# EAGLE design untitled (EAGLE 7.7.0)
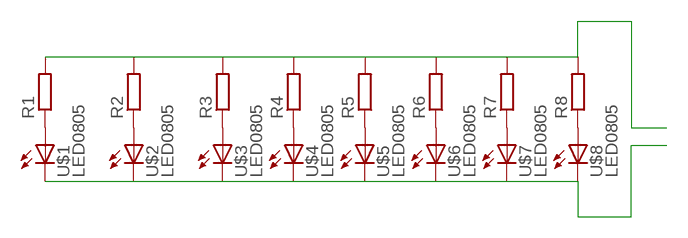
[diagram p0: schematic, sheet 1]

## Parts
R1  R0603  [0603]
R2  R0603  [0603]
R3  R0603  [0603]
R4  R0603  [0603]
R5  R0603  [0603]
R6  R0603  [0603]
R7  R0603  [0603]
R8  R0603  [0603]
U$1  LED0805  [0805-LED]
U$2  LED0805  [0805-LED]
U$3  LED0805  [0805-LED]
U$4  LED0805  [0805-LED]
U$5  LED0805  [0805-LED]
U$6  LED0805  [0805-LED]
U$7  LED0805  [0805-LED]
U$8  LED0805  [0805-LED]

## Nets
N$1: R1.1 U$1.A
N$2: R2.1 U$2.A
N$3: R3.1 U$3.A
N$4: R4.1 U$4.A
N$5: R5.1 U$5.A
N$6: R6.1 U$6.A
N$7: R7.1 U$7.A
N$8: R8.1 U$8.A
N$9: R1.2 R2.2 R3.2 R4.2 R5.2 R6.2 R7.2 R8.2
N$10: U$1.C U$2.C U$3.C U$4.C U$5.C U$6.C U$7.C U$8.C

## Library data of the parts
R1-R8 = smalsmd:R
U$1-U$8 = smalsmd:LED

## Board
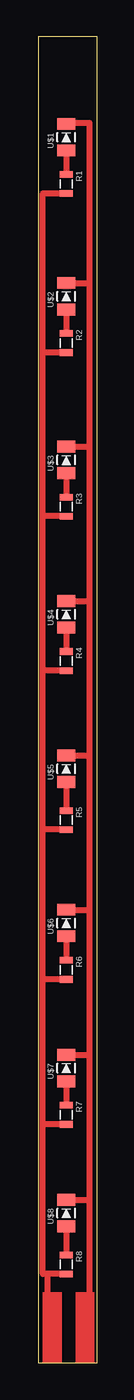
[diagram p1: board, top side]

Size 4 x 90 mm. Coordinates in mm from the lower left corner, seen from the top.
Outline: 0,0 4,0 4,90 0,90 0,0
Copper layers (1*16): Top 0.035mm / dielectric 1.5mm / Bottom 0.035mm
Design rules "default": minimum track width 10mil, minimum drill 24mil, track to track 8mil, track to pad 8mil, pad to pad 8mil, via to via 8mil, smd to smd 8mil, copper to edge 40mil, drill to drill 8mil, minimum pad ring 10mil, minimum via ring 8mil, stop-mask expansion 4mil, vias tented up to drill 0mil, thermal gap 10mil

### Footprints (pad centres in the part's own frame; a part is rotated, then mirrored left to right if it is on the bottom)
0603 = smd 0.45 x 0.9: 1 -0.65,0; 2 0.65,0
0805-LED = smd 0.8 x 1.2: A -0.9,0; C 0.9,0

### Placement (x,y rotation side)
R1  1.91,80.01 270 top
R2  1.91,69.22 270 top
R3  1.91,58.1 270 top
R4  1.91,47.62 270 top
R5  1.91,36.83 270 top
R6  1.91,26.67 270 top
R7  1.91,16.83 270 top
R8  1.91,6.67 270 top
U$1  1.91,83.19 90 top
U$2  1.91,72.39 90 top
U$3  1.91,61.28 90 top
U$4  1.91,50.8 90 top
U$5  1.91,40.32 90 top
U$6  1.91,29.84 90 top
U$7  1.91,20 90 top
U$8  1.91,10.16 90 top

### Tracks (layer width: path | path; a pad name or v marks a point on that pad's centre or on a via)
N$1
  Top 0.406: U$1.A R1.1
N$2
  Top 0.406: U$2.A R2.1
N$3
  Top 0.406: U$3.A R3.1
N$4
  Top 0.406: U$4.A R4.1
N$5
  Top 0.406: U$5.A R5.1
N$6
  Top 0.406: U$6.A R6.1
N$7
  Top 0.406: U$7.A R7.1
N$8
  Top 0.406: U$8.A R8.1
N$9
  Top 0.406: 0.64,1.59 0.64,6.02 | 0.64,6.02 0.32,6.02 0.32,16.18 | 0.32,16.18 0.32,26.02 | 0.32,26.02 0.32,36.18 | 0.32,36.18 0.32,46.98 | 0.32,46.98 0.32,57.45 | 0.32,57.45 0.32,68.56 | 0.32,68.56 0.32,79.38 1.91,79.38 R1.2 | R2.2 0.32,68.56 | R3.2 0.32,57.45 | R4.2 0.32,46.98 | R5.2 0.32,36.18 | R6.2 0.32,26.02 | R7.2 0.32,16.18 | R8.2 0.64,6.02
N$10
  Top 0.406: 3.49,1.59 3.49,11.06 | 3.49,20.9 3.49,11.11 3.49,11.06 | 3.49,20.9 3.49,30.75 | 3.49,30.75 3.49,41.22 | 3.49,41.22 3.49,51.7 | 3.49,51.7 3.49,62.18 | 3.49,62.18 3.49,73.29 | 3.49,73.29 3.49,84.14 1.91,84.14 U$1.C | U$2.C 3.49,73.29 | U$3.C 3.49,62.18 | U$4.C 3.49,51.7 | U$5.C 3.49,41.22 | U$6.C 3.49,30.75 | U$7.C 3.49,20.9 | U$8.C 3.49,11.06
(copper drawn outside any net)
  shapes: Top area x2